# Altium schematic sheet M.SchDoc
size A
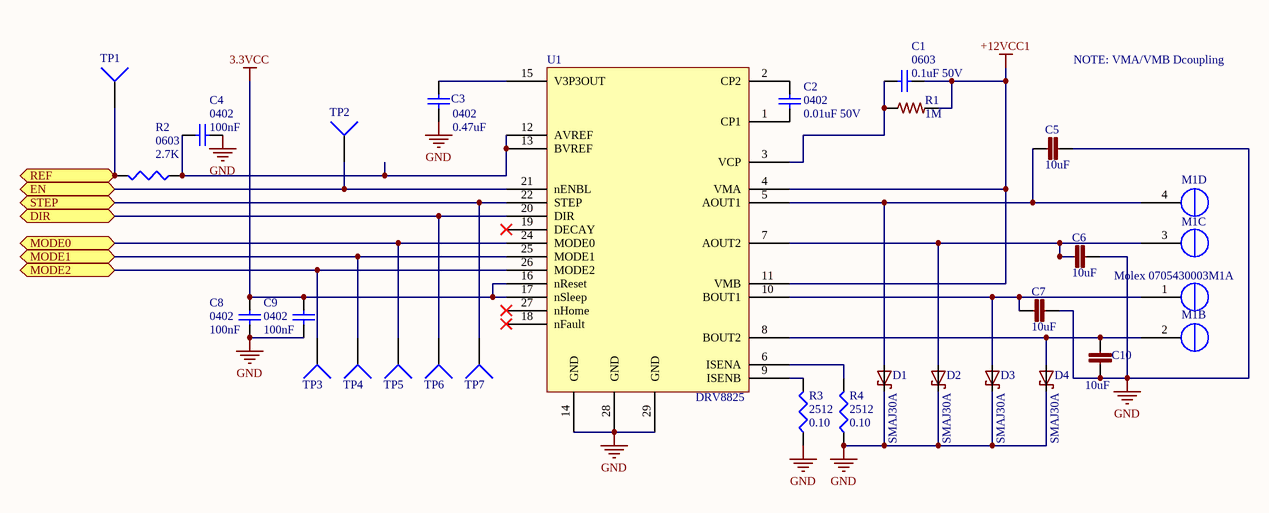
[diagram p0: M.SchDoc]

## Parts
C1  0603  value 0.1uF 50V  [1608[0603]]
C2  value 0.01uF 50V  [C0402]  (hidden comment: 0402)
C3  value 0.47uF  [C0402]  (hidden comment: 0402)
C4  value 100nF  [C0402]  (hidden comment: 0402)
C5  10uF  [C0603]
C6  10uF  [C0603]
C7  10uF  [C0603]
C8  value 100nF  [C0402]  (hidden comment: 0402)
C9  value 100nF  [C0402]  (hidden comment: 0402)
C10  10uF  [C0603]
D1  SMAJ30A  [SMA-SM]
D2  SMAJ30A  [SMA-SM]
D3  SMAJ30A  [SMA-SM]
D4  SMAJ30A  [SMA-SM]
M1  Molex 0705430003  [4POL254]  (parts A,B,C,D of 4)
R1  1M  [R0402]
R2  0603  value 2.7K  [J1-0603]
R3  2512  value 0.10  [Resistor2512]
R4  2512  value 0.10  [Resistor2512]
TP1  TP4  [TP-2]  (value not drawn)
TP2  TP4  [TP-2]  (value not drawn)
TP3  TP4  [TP-2]  (value not drawn)
TP4  TP4  [TP-2]  (value not drawn)
TP5  TP4  [TP-2]  (value not drawn)
TP6  TP4  [TP-2]  (value not drawn)
TP7  TP4  [TP-2]  (value not drawn)
U1  DRV8825  [DRV8825]

## Ports
DIR, EN, MODE0, MODE1, MODE2, REF, STEP

## Nets
3.3VCC: C8.2 C9.2 U1.16(nReset) U1.17(nSleep)
+12VCC1: C1.1 R1.2 U1.4(VMA) U1.11(VMB)
GND: C3.1 C4.1 C5.2 C6.2 C7.2 C8.1 C9.1 C10.2 D1.C D2.C D3.C D4.C R3.1 R4.1 U1.14(GND) U1.28(GND) U1.29(GND)
DIR: TP6.1 U1.20(DIR) ; port DIR
EN: TP2.1 U1.21(nENBL) ; port EN
MODE0: TP5.1 U1.24(MODE0) ; port MODE0
MODE1: TP4.1 U1.25(MODE1) ; port MODE1
MODE2: TP3.1 U1.26(MODE2) ; port MODE2
REF: R2.2 TP1.1 ; port REF
STEP: TP7.1 U1.22(STEP) ; port STEP
NetC1_2: C1.2 R1.1 U1.3(VCP)
NetC2_1: C2.1 U1.1(CP1)
NetC2_2: C2.2 U1.2(CP2)
NetC3_2: C3.2 U1.15(V3P3OUT)
NetC4_2: C4.2 R2.1 U1.12(AVREF) U1.13(BVREF)
NetC5_1: C5.1 D1.A M1.4(OUT1B) U1.5(AOUT1)
NetC6_1: C6.1 D2.A M1.3(OUT1A) U1.7(AOUT2)
NetC7_1: C7.1 D3.A M1.1(OUT2B) U1.10(BOUT1)
NetC10_1: C10.1 D4.A M1.2(OUT2A) U1.8(BOUT2)
NetR3_2: R3.2 U1.9(ISENB)
NetR4_2: R4.2 U1.6(ISENA)

Not connected (* = marked no-connect by the designer): U1 18(nFault)* 19(DECAY)* 23(NC) 27(nHome)*

## Notes on the sheet
- NOTE: VMA/VMB Dcoupling

## Library data of the parts
C1 = Cap Semi: Capacitor (Semiconductor SIM Model); Published: 8-Jun-2000; LatestRevisionDate: 29-May-2009; LatestRevisionNote: IPC-7351 Footprint Added.; PackageReference: C1206; Publisher: Altium Limited; PackageDescription: Chip Capacitor
C2 = GRM155R71H103JA88D: CAP CER 10000PF 50V X7R 0402; MFR: Murata; Tolerance: 10%; Voltage: 6.3VDC; Published: 10 - Dec - 2014; LatestRevisionDate: 10 - Dec - 2014; LatestRevisionNote: Ultimachine Footprint Added; Publisher: Ultimachine; Component Type: Chip Capacitor; MFR Part #: GRM155R71H103JA88D; Part Description: CAP CER 10000PF 50V X7R 0402; Mounting Type: SMT 0402; Datasheet: http://search.murata.co.jp/Ceramy/image/img/A01X/G101/ENG/GRM155R71H103JA88-01.pdf; Height: 0.5 ±0.05mm; Digikey #: 490-7763-1-ND; PackageReference: 0402
C3 = GRM155R60J474KE19D: 0.47uF 6.3v C0402 - GRM155R60J474KE19D; MFR: Murata; Part Description: CAP CER 0.47UF 6.3V 10% X5R 0402; Tolerance: 10%; Voltage: 6.3VDC; Published: 10 - Dec - 2014; LatestRevisionDate: 10 - Dec - 2014; LatestRevisionNote: Ultimachine Footprint Added; Publisher: Ultimachine; Component Type: Chip Capacitor; MFR Part #: GRM155R60J474KE19D; Mounting Type: SMT 0402; Datasheet: http://search.murata.co.jp/Ceramy/image/img/A01X/G101/ENG/GRM155R60J474KE19-01.pdf; Height: 0.5 ±0.05mm; PackageReference: 0402
C4 C8 C9 = 100nF C0402 - GRM155R71C104KA88D: Capacitor (Semiconductor SIM Model); MFR: Murata; Part Description: CAP CER 0.1UF 16V 10% X7R 0402; Tolerance: 10%; Voltage: 16v; Published: 10 - Dec - 2014; LatestRevisionDate: 10 - Dec - 2014; LatestRevisionNote: Ultimachine Footprint Added; Publisher: Ultimachine; Component Type: Chip Capacitor; MFR Part #: GRM155R71C104KA88D; Mounting Type: SMT 0402; Datasheet: http://psearch.murata.com/capacitor/product/GRM155R71C104KA88%23.pdf; Height: 0.5 ±0.05mm; PackageReference: 0402
C5-C7 C10 = CC0603ZRY5V6BB105: CAP CER 0603 1uF 10V Y5V; LastRevisionNote: ImportComponents; Published: 23-Apr-2014; Publisher: UltiMachine; LastRevisionDate: 23-Apr-2014; ManufacturerPartNumber: CC0603ZRY5V6BB105; VALUE: 10uF
D1-D4 = SMAJ30A: DIODE TVS 30V SMA; LastRevisionNote: ImportComponents; Published: 23-Apr-2014; Publisher: UltiMachine; LastRevisionDate: 23-Apr-2014; ManufacturerPartNumber: SMAJ30A
M1 = Molex 0705430003 Alt: Molex 4 Pin Clip Connector
R1 = ERJ2GEJ105X: RES 0402 1M 100mW 5%; LastRevisionNote: ImportComponents; Published: 23-Apr-2014; Publisher: UltiMachine; LastRevisionDate: 23-Apr-2014; ManufacturerPartNumber: ERJ2GEJ105X; VALUE: 1M
R2-R4 = Res3: Resistor; Published: 8-Jun-2000; LatestRevisionDate: 29-May-2009; LatestRevisionNote: IPC-7351 Footprint Added.; PackageReference: J1-0603; Publisher: Altium Limited; PackageDescription: Chip Resistor
TP1-TP7 = Socket: LatestRevisionDate: 17-Jul-2002; LatestRevisionNote: Re-released for DXP Platform.; Publisher: Altium Limited
U1 = DRV8825: DRV8825 Ti Stepper Driver